# Altium schematic sheet 采集卡.SchDoc
size A4
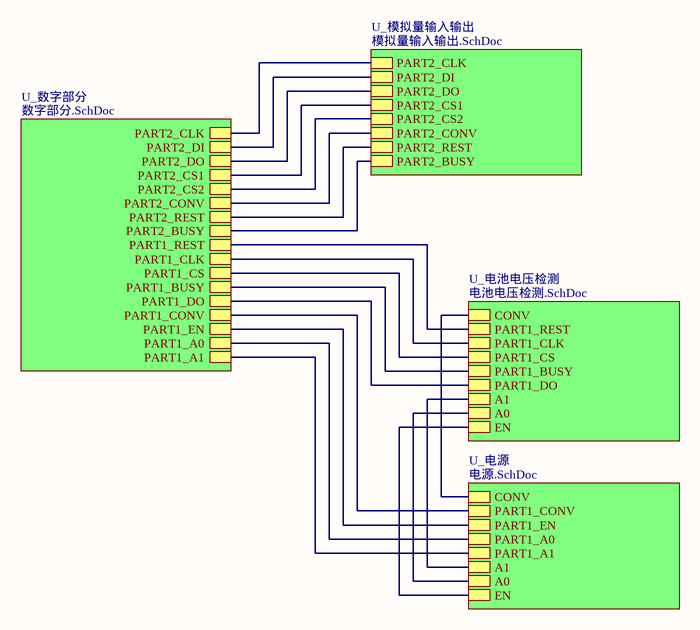
[diagram p0: 采集卡.SchDoc]

## Sub-sheets
U_数字部分 = 数字部分.SchDoc: PART1_REST, PART1_CLK, PART1_CS, PART1_BUSY, PART1_DO, PART1_CONV, PART1_EN, PART1_A0, PART1_A1, PART2_CLK, PART2_DI, PART2_DO, PART2_CS1, PART2_CS2, PART2_CONV, PART2_REST, PART2_BUSY
U_模拟量输入输出 = 模拟量输入输出.SchDoc: PART2_CLK, PART2_DI, PART2_DO, PART2_CS1, PART2_CS2, PART2_CONV, PART2_REST, PART2_BUSY
U_电池电压检测 = 电池电压检测.SchDoc: CONV, PART1_REST, PART1_CLK, PART1_CS, PART1_BUSY, PART1_DO, A1, A0, EN
U_电源 = 电源.SchDoc: CONV, PART1_CONV, PART1_EN, PART1_A0, PART1_A1, A1, A0, EN

## Nets
(unnamed): sheet U_模拟量输入输出/PART2_CLK, sheet U_数字部分/PART2_CLK
(unnamed): sheet U_模拟量输入输出/PART2_DI, sheet U_数字部分/PART2_DI
(unnamed): sheet U_模拟量输入输出/PART2_DO, sheet U_数字部分/PART2_DO
(unnamed): sheet U_模拟量输入输出/PART2_CS1, sheet U_数字部分/PART2_CS1
(unnamed): sheet U_模拟量输入输出/PART2_CS2, sheet U_数字部分/PART2_CS2
(unnamed): sheet U_模拟量输入输出/PART2_CONV, sheet U_数字部分/PART2_CONV
(unnamed): sheet U_模拟量输入输出/PART2_REST, sheet U_数字部分/PART2_REST
(unnamed): sheet U_模拟量输入输出/PART2_BUSY, sheet U_数字部分/PART2_BUSY
(unnamed): sheet U_电池电压检测/CONV, sheet U_电源/CONV
(unnamed): sheet U_电池电压检测/PART1_REST, sheet U_数字部分/PART1_REST
(unnamed): sheet U_电池电压检测/PART1_CLK, sheet U_数字部分/PART1_CLK
(unnamed): sheet U_电池电压检测/PART1_CS, sheet U_数字部分/PART1_CS
(unnamed): sheet U_电池电压检测/PART1_BUSY, sheet U_数字部分/PART1_BUSY
(unnamed): sheet U_电池电压检测/PART1_DO, sheet U_数字部分/PART1_DO
(unnamed): sheet U_电池电压检测/A1, sheet U_电源/A1
(unnamed): sheet U_电池电压检测/A0, sheet U_电源/A0
(unnamed): sheet U_电池电压检测/EN, sheet U_电源/EN
(unnamed): sheet U_电源/PART1_CONV, sheet U_数字部分/PART1_CONV
(unnamed): sheet U_电源/PART1_EN, sheet U_数字部分/PART1_EN
(unnamed): sheet U_电源/PART1_A0, sheet U_数字部分/PART1_A0
(unnamed): sheet U_电源/PART1_A1, sheet U_数字部分/PART1_A1